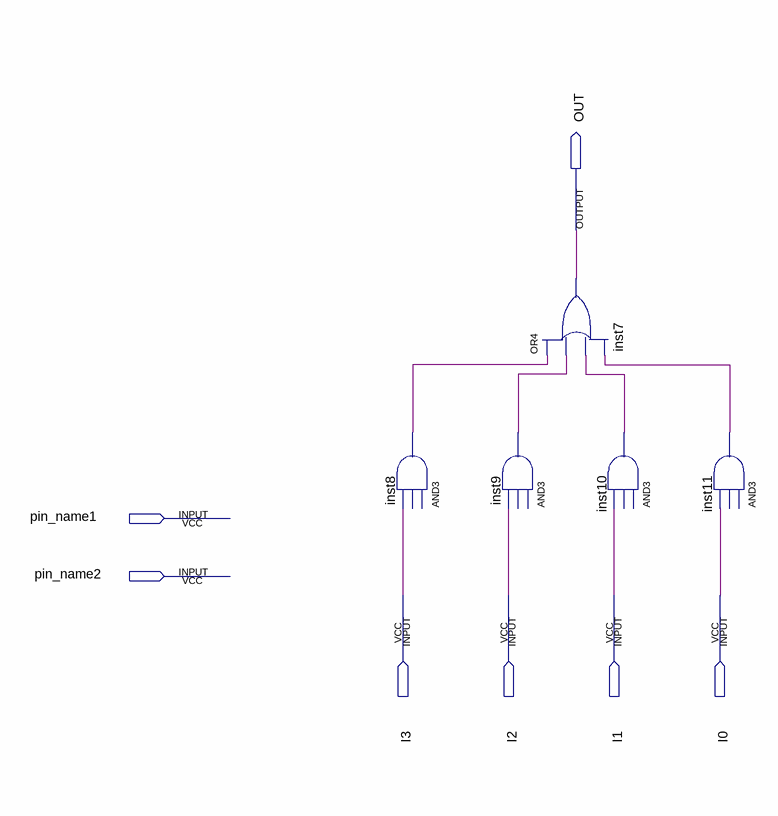
[diagram p0: schematic sheet]
// Quartus schematic my_mux_4_1.bdf as structural Verilog: 5 symbols, 7 pins
module my_mux_4_1 (
  input  pin_name1,
  input  pin_name2,
  input  I3,
  input  I2,
  input  I1,
  input  I0,
  output OUT
);

  wire inst8_out, inst9_out, inst10_out, inst11_out;

  buf inst8 (inst8_out, I3);  // AND3 open: IN1, IN2
  buf inst9 (inst9_out, I2);  // AND3 open: IN1, IN2
  or inst7 (OUT, inst8_out, inst9_out, inst10_out, inst11_out);
  buf inst10 (inst10_out, I1);  // AND3 open: IN1, IN2
  buf inst11 (inst11_out, I0);  // AND3 open: IN1, IN2
endmodule
